# Altium schematic sheet [04]-BUTTON.SchDoc
size A
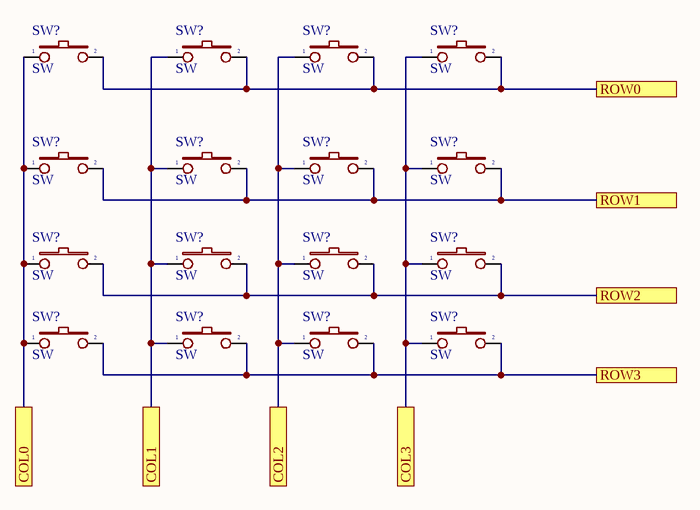
[diagram p0: [04]-BUTTON.SchDoc]

## Parts
(Parts that share a designator on the sheet are numbered #1, #2 ... from top to bottom, then left to right.)
SW?#1  SW  [SW2]
SW?#2  SW  [SW2]
SW?#3  SW  [SW2]
SW?#4  SW  [SW2]
SW?#5  SW  [SW2]
SW?#6  SW  [SW2]
SW?#7  SW  [SW2]
SW?#8  SW  [SW2]
SW?#9  SW  [SW2]
SW?#10  SW  [SW2]
SW?#11  SW  [SW2]
SW?#12  SW  [SW2]
SW?#13  SW  [SW2]
SW?#14  SW  [SW2]
SW?#15  SW  [SW2]
SW?#16  SW  [SW2]

## Ports
COL0, COL1, COL2, COL3, ROW0, ROW1, ROW2, ROW3

## Nets
COL0: SW?#1.1 SW?#5.1 SW?#9.1 SW?#13.1 ; port COL0
COL1: SW?#2.1 SW?#6.1 SW?#10.1 SW?#14.1 ; port COL1
COL2: SW?#3.1 SW?#7.1 SW?#11.1 SW?#15.1 ; port COL2
COL3: SW?#4.1 SW?#8.1 SW?#12.1 SW?#16.1 ; port COL3
ROW0: SW?#1.2 SW?#2.2 SW?#3.2 SW?#4.2 ; port ROW0
ROW1: SW?#5.2 SW?#6.2 SW?#7.2 SW?#8.2 ; port ROW1
ROW2: SW?#9.2 SW?#10.2 SW?#11.2 SW?#12.2 ; port ROW2
ROW3: SW?#13.2 SW?#14.2 SW?#15.2 SW?#16.2 ; port ROW3

## Library data of the parts
SW?#1-SW?#16 = SW2: Switch button 2 pin; Value: SW chip 2 pin